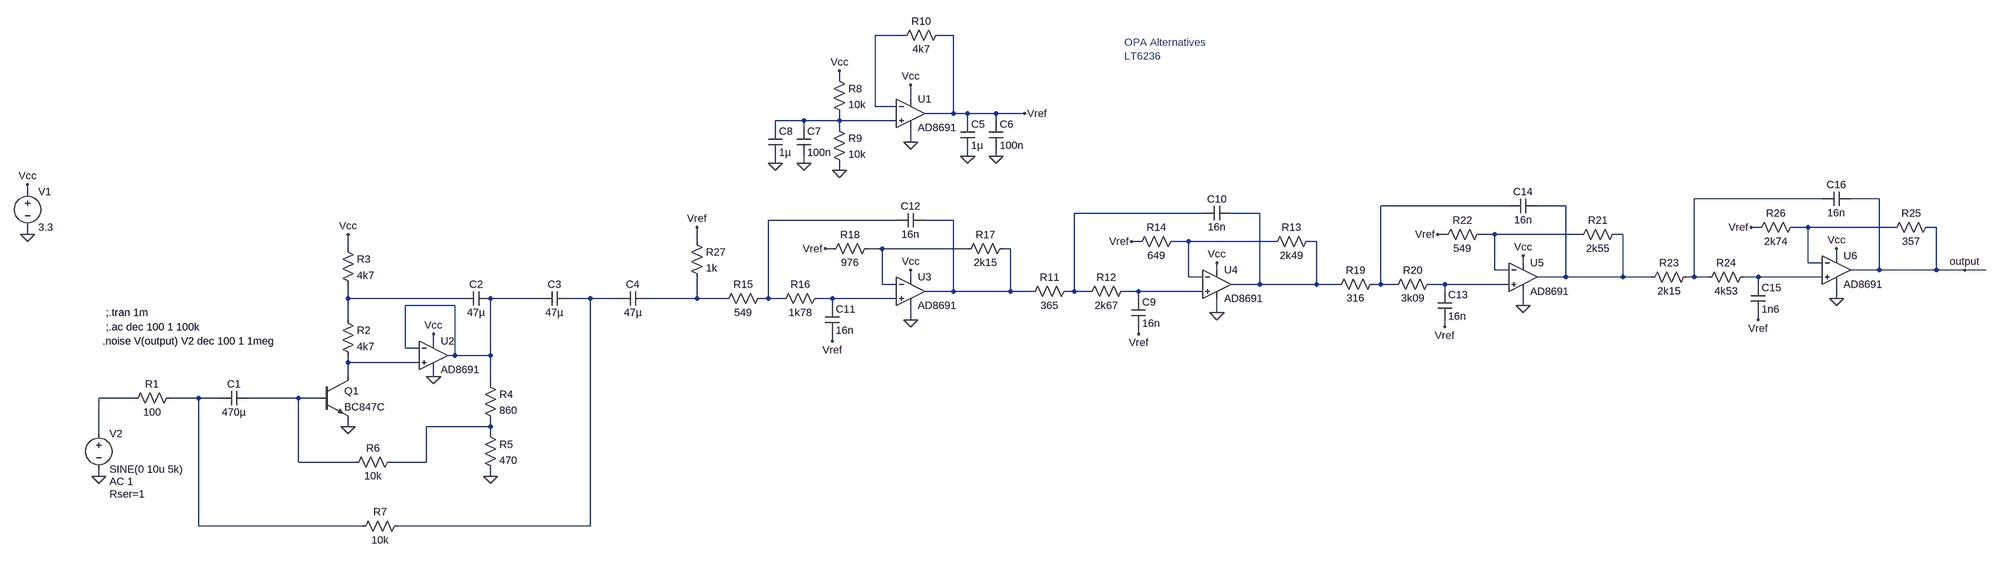
[diagram p0: schematic NPN+Filter.asc]
NPN+Filter.asc, the LTspice schematic file:
Version 4
SHEET 1 5240 900
WIRE 1968 -272 1904 -272
WIRE 2080 -272 2048 -272
WIRE 1824 -176 1824 -192
WIRE 1984 -128 1984 -160
WIRE 1904 -112 1904 -272
WIRE 1952 -112 1904 -112
WIRE 2080 -96 2080 -272
WIRE 2080 -96 2016 -96
WIRE 2112 -96 2080 -96
WIRE 2176 -96 2112 -96
WIRE 2240 -96 2176 -96
WIRE 1744 -80 1680 -80
WIRE 1824 -80 1824 -96
WIRE 1824 -80 1744 -80
WIRE 1952 -80 1824 -80
WIRE 2112 -80 2112 -96
WIRE 2176 -80 2176 -96
WIRE 1680 -64 1680 -80
WIRE 1744 -64 1744 -80
WIRE 1824 -64 1824 -80
WIRE 1984 -32 1984 -64
WIRE 2112 0 2112 -16
WIRE 2176 0 2176 -16
WIRE 1680 16 1680 0
WIRE 1744 16 1744 0
WIRE 1824 32 1824 16
WIRE 0 80 0 64
WIRE 4032 96 3744 96
WIRE 4160 96 4096 96
WIRE 3328 112 3040 112
WIRE 3456 112 3392 112
WIRE 2640 128 2352 128
WIRE 2768 128 2704 128
WIRE 1952 144 1664 144
WIRE 2080 144 2016 144
WIRE 3888 160 3872 160
WIRE 4000 160 3968 160
WIRE 4192 160 4000 160
WIRE 4288 160 4272 160
WIRE 0 176 0 160
WIRE 3184 176 3168 176
WIRE 3296 176 3264 176
WIRE 3488 176 3296 176
WIRE 3584 176 3568 176
WIRE 1504 192 1504 160
WIRE 2496 192 2480 192
WIRE 2608 192 2576 192
WIRE 2800 192 2608 192
WIRE 2896 192 2880 192
WIRE 720 208 720 176
WIRE 1808 208 1792 208
WIRE 1920 208 1888 208
WIRE 2112 208 1920 208
WIRE 2208 208 2192 208
WIRE 4064 224 4064 208
WIRE 3360 240 3360 224
WIRE 4000 240 4000 160
WIRE 4032 240 4000 240
WIRE 2672 256 2672 240
WIRE 3296 256 3296 176
WIRE 3328 256 3296 256
WIRE 4160 256 4160 96
WIRE 4160 256 4096 256
WIRE 4288 256 4288 160
WIRE 4288 256 4160 256
WIRE 4352 256 4288 256
WIRE 4400 256 4352 256
WIRE 1984 272 1984 256
WIRE 2608 272 2608 192
WIRE 2640 272 2608 272
WIRE 3456 272 3456 112
WIRE 3456 272 3392 272
WIRE 3584 272 3584 176
WIRE 3584 272 3456 272
WIRE 3648 272 3584 272
WIRE 3744 272 3744 96
WIRE 3744 272 3728 272
WIRE 3776 272 3744 272
WIRE 3888 272 3856 272
WIRE 4032 272 3888 272
WIRE 1920 288 1920 208
WIRE 1952 288 1920 288
WIRE 2768 288 2768 128
WIRE 2768 288 2704 288
WIRE 2896 288 2896 192
WIRE 2896 288 2768 288
WIRE 2944 288 2896 288
WIRE 3040 288 3040 112
WIRE 3040 288 3024 288
WIRE 3072 288 3040 288
WIRE 3184 288 3152 288
WIRE 3328 288 3184 288
WIRE 3888 288 3888 272
WIRE 2080 304 2080 144
WIRE 2080 304 2016 304
WIRE 2208 304 2208 208
WIRE 2208 304 2080 304
WIRE 2256 304 2208 304
WIRE 2352 304 2352 128
WIRE 2352 304 2336 304
WIRE 2384 304 2352 304
WIRE 2496 304 2464 304
WIRE 2640 304 2496 304
WIRE 3184 304 3184 288
WIRE 720 320 720 288
WIRE 976 320 720 320
WIRE 1152 320 1040 320
WIRE 1264 320 1216 320
WIRE 1328 320 1264 320
WIRE 1504 320 1504 272
WIRE 1504 320 1392 320
WIRE 1568 320 1504 320
WIRE 1664 320 1664 144
WIRE 1664 320 1648 320
WIRE 1696 320 1664 320
WIRE 1808 320 1776 320
WIRE 1952 320 1808 320
WIRE 2496 320 2496 304
WIRE 4064 320 4064 288
WIRE 960 336 848 336
WIRE 1808 336 1808 320
WIRE 3360 336 3360 304
WIRE 2672 352 2672 320
WIRE 720 368 720 320
WIRE 1984 368 1984 336
WIRE 3888 368 3888 352
WIRE 3184 384 3184 368
WIRE 2496 400 2496 384
WIRE 912 416 912 400
WIRE 1808 416 1808 400
WIRE 848 432 848 336
WIRE 880 432 848 432
WIRE 960 448 960 336
WIRE 960 448 944 448
WIRE 1040 448 1040 320
WIRE 1040 448 960 448
WIRE 720 464 720 448
WIRE 880 464 720 464
WIRE 720 496 720 464
WIRE 912 496 912 480
WIRE 1040 512 1040 448
WIRE 240 544 160 544
WIRE 384 544 320 544
WIRE 432 544 384 544
WIRE 608 544 496 544
WIRE 656 544 608 544
WIRE 720 608 720 592
WIRE 1040 608 1040 592
WIRE 1040 608 896 608
WIRE 160 624 160 544
WIRE 1040 624 1040 608
WIRE 608 688 608 544
WIRE 736 688 608 688
WIRE 896 688 896 608
WIRE 896 688 816 688
WIRE 160 720 160 704
WIRE 1040 720 1040 704
WIRE 384 832 384 544
WIRE 752 832 384 832
WIRE 1264 832 1264 320
WIRE 1264 832 832 832
FLAG 0 176 0
FLAG 0 64 Vcc
FLAG 160 720 0
FLAG 720 608 0
FLAG 720 176 Vcc
FLAG 912 400 Vcc
FLAG 912 496 0
FLAG 1040 720 0
FLAG 1984 -32 0
FLAG 1984 -160 Vcc
FLAG 1824 -192 Vcc
FLAG 1824 32 0
FLAG 2112 0 0
FLAG 2176 0 0
FLAG 2240 -96 Vref
FLAG 1680 16 0
FLAG 1744 16 0
FLAG 2496 400 Vref
FLAG 2672 352 0
FLAG 2672 240 Vcc
FLAG 2480 192 Vref
FLAG 1808 416 Vref
FLAG 1984 256 Vcc
FLAG 1792 208 Vref
FLAG 4352 256 output
FLAG 3184 384 Vref
FLAG 3360 336 0
FLAG 3360 224 Vcc
FLAG 3168 176 Vref
FLAG 3888 368 Vref
FLAG 4064 320 0
FLAG 4064 208 Vcc
FLAG 3872 160 Vref
FLAG 1984 368 0
FLAG 1504 160 Vref
SYMBOL voltage 0 64 R0
WINDOW 123 0 0 Left 0
WINDOW 39 0 0 Left 0
SYMATTR InstName V1
SYMATTR Value 3.3
SYMBOL voltage 160 608 R0
WINDOW 123 24 124 Left 2
WINDOW 39 24 152 Left 2
SYMATTR Value2 AC 1
SYMATTR SpiceLine Rser=1
SYMATTR InstName V2
SYMATTR Value SINE(0 10u 5k)
SYMBOL res 336 528 R90
WINDOW 0 0 56 VBottom 2
WINDOW 3 32 56 VTop 2
SYMATTR InstName R1
SYMATTR Value 100
SYMBOL npn 656 496 R0
SYMATTR InstName Q1
SYMATTR Value BC847C
SYMBOL res 704 352 R0
SYMATTR InstName R2
SYMATTR Value 4k7
SYMBOL res 704 192 R0
SYMATTR InstName R3
SYMATTR Value 4k7
SYMBOL cap 1040 304 R90
WINDOW 0 0 32 VBottom 2
WINDOW 3 32 32 VTop 2
SYMATTR InstName C2
SYMATTR Value 47µ
SYMBOL cap 1216 304 R90
WINDOW 0 0 32 VBottom 2
WINDOW 3 32 32 VTop 2
SYMATTR InstName C3
SYMATTR Value 47µ
SYMBOL res 1024 496 R0
SYMATTR InstName R4
SYMATTR Value 860
SYMBOL res 1024 608 R0
SYMATTR InstName R5
SYMATTR Value 470
SYMBOL res 832 672 R90
WINDOW 0 0 56 VBottom 2
WINDOW 3 32 56 VTop 2
SYMATTR InstName R6
SYMATTR Value 10k
SYMBOL res 848 816 R90
WINDOW 0 0 56 VBottom 2
WINDOW 3 32 56 VTop 2
SYMATTR InstName R7
SYMATTR Value 10k
SYMBOL cap 496 528 R90
WINDOW 0 0 32 VBottom 2
WINDOW 3 32 32 VTop 2
SYMATTR InstName C1
SYMATTR Value 470µ
SYMBOL cap 1392 304 R90
WINDOW 0 0 32 VBottom 2
WINDOW 3 32 32 VTop 2
SYMATTR InstName C4
SYMATTR Value 47µ
SYMBOL res 1808 -192 R0
SYMATTR InstName R8
SYMATTR Value 10k
SYMBOL res 1808 -80 R0
SYMATTR InstName R9
SYMATTR Value 10k
SYMBOL cap 2096 -80 R0
SYMATTR InstName C5
SYMATTR Value 1µ
SYMBOL cap 2160 -80 R0
SYMATTR InstName C6
SYMATTR Value 100n
SYMBOL cap 1728 -64 R0
SYMATTR InstName C7
SYMATTR Value 100n
SYMBOL cap 1664 -64 R0
SYMATTR InstName C8
SYMATTR Value 1µ
SYMBOL res 2064 -288 R90
WINDOW 0 0 56 VBottom 2
WINDOW 3 32 56 VTop 2
SYMATTR InstName R10
SYMATTR Value 4k7
SYMBOL res 2352 288 R90
WINDOW 0 0 56 VBottom 2
WINDOW 3 32 56 VTop 2
SYMATTR InstName R11
SYMATTR Value 365
SYMBOL res 2480 288 R90
WINDOW 0 0 56 VBottom 2
WINDOW 3 32 56 VTop 2
SYMATTR InstName R12
SYMATTR Value 2k67
SYMBOL cap 2480 320 R0
SYMATTR InstName C9
SYMATTR Value 16n
SYMBOL cap 2704 112 R90
WINDOW 0 0 32 VBottom 2
WINDOW 3 32 32 VTop 2
SYMATTR InstName C10
SYMATTR Value 16n
SYMBOL res 2896 176 R90
WINDOW 0 0 56 VBottom 2
WINDOW 3 32 56 VTop 2
SYMATTR InstName R13
SYMATTR Value 2k49
SYMBOL res 2592 176 R90
WINDOW 0 0 56 VBottom 2
WINDOW 3 32 56 VTop 2
SYMATTR InstName R14
SYMATTR Value 649
SYMBOL res 1664 304 R90
WINDOW 0 0 56 VBottom 2
WINDOW 3 32 56 VTop 2
SYMATTR InstName R15
SYMATTR Value 549
SYMBOL res 1792 304 R90
WINDOW 0 0 56 VBottom 2
WINDOW 3 32 56 VTop 2
SYMATTR InstName R16
SYMATTR Value 1k78
SYMBOL cap 1792 336 R0
SYMATTR InstName C11
SYMATTR Value 16n
SYMBOL cap 2016 128 R90
WINDOW 0 0 32 VBottom 2
WINDOW 3 32 32 VTop 2
SYMATTR InstName C12
SYMATTR Value 16n
SYMBOL res 2208 192 R90
WINDOW 0 0 56 VBottom 2
WINDOW 3 32 56 VTop 2
SYMATTR InstName R17
SYMATTR Value 2k15
SYMBOL res 1904 192 R90
WINDOW 0 0 56 VBottom 2
WINDOW 3 32 56 VTop 2
SYMATTR InstName R18
SYMATTR Value 976
SYMBOL res 3040 272 R90
WINDOW 0 0 56 VBottom 2
WINDOW 3 32 56 VTop 2
SYMATTR InstName R19
SYMATTR Value 316
SYMBOL res 3168 272 R90
WINDOW 0 0 56 VBottom 2
WINDOW 3 32 56 VTop 2
SYMATTR InstName R20
SYMATTR Value 3k09
SYMBOL cap 3168 304 R0
SYMATTR InstName C13
SYMATTR Value 16n
SYMBOL cap 3392 96 R90
WINDOW 0 0 32 VBottom 2
WINDOW 3 32 32 VTop 2
SYMATTR InstName C14
SYMATTR Value 16n
SYMBOL res 3584 160 R90
WINDOW 0 0 56 VBottom 2
WINDOW 3 32 56 VTop 2
SYMATTR InstName R21
SYMATTR Value 2k55
SYMBOL res 3280 160 R90
WINDOW 0 0 56 VBottom 2
WINDOW 3 32 56 VTop 2
SYMATTR InstName R22
SYMATTR Value 549
SYMBOL res 3744 256 R90
WINDOW 0 0 56 VBottom 2
WINDOW 3 32 56 VTop 2
SYMATTR InstName R23
SYMATTR Value 2k15
SYMBOL res 3872 256 R90
WINDOW 0 0 56 VBottom 2
WINDOW 3 32 56 VTop 2
SYMATTR InstName R24
SYMATTR Value 4k53
SYMBOL cap 3872 288 R0
SYMATTR InstName C15
SYMATTR Value 1n6
SYMBOL cap 4096 80 R90
WINDOW 0 0 32 VBottom 2
WINDOW 3 32 32 VTop 2
SYMATTR InstName C16
SYMATTR Value 16n
SYMBOL res 4288 144 R90
WINDOW 0 0 56 VBottom 2
WINDOW 3 32 56 VTop 2
SYMATTR InstName R25
SYMATTR Value 357
SYMBOL res 3984 144 R90
WINDOW 0 0 56 VBottom 2
WINDOW 3 32 56 VTop 2
SYMATTR InstName R26
SYMATTR Value 2k74
SYMBOL OpAmps\\AD8691 1984 -160 R0
SYMATTR InstName U1
SYMBOL OpAmps\\AD8691 1984 240 R0
SYMATTR InstName U3
SYMBOL OpAmps\\AD8691 2672 224 R0
SYMATTR InstName U4
SYMBOL OpAmps\\AD8691 3360 208 R0
SYMATTR InstName U5
SYMBOL OpAmps\\AD8691 4064 192 R0
SYMATTR InstName U6
SYMBOL res 1488 176 R0
SYMATTR InstName R27
SYMATTR Value 1k
SYMBOL OpAmps\\AD8691 912 384 R0
SYMATTR InstName U2
TEXT 176 352 Left 2 !;.tran 1m
TEXT 176 384 Left 2 !;.ac dec 100 1 100k
TEXT 168 416 Left 2 !.noise V(output) V2 dec 100 1 1meg
TEXT 2464 -256 Left 2 ;OPA Alternatives\nLT6236

The netlist it stands for:
* NPN+Filter.asc
V1 Vcc 0 3.3
V2 N023 0 SINE(0 10u 5k) AC 1 Rser=1
R1 N024 N023 100
Q1 N022 N025 0 0 BC847C
R2 N017 N022 4k7
R3 Vcc N017 4k7
C2 N018 N017 47µ
C3 N019 N018 47µ
R4 N018 N026 860
R5 N026 0 470
R6 N026 N025 10k
R7 N019 N024 10k
C1 N025 N024 470µ
C4 N020 N019 47µ
R8 Vcc N002 10k
R9 N002 0 10k
C5 Vref 0 1µ
C6 Vref 0 100n
C7 N002 0 100n
C8 N002 0 1µ
R10 Vref N001 4k7
R11 N006 N009 365
R12 N016 N006 2k67
C9 N016 Vref 16n
C10 N007 N006 16n
R13 N007 N012 2k49
R14 N012 Vref 649
R15 N008 N020 549
R16 N021 N008 1k78
C11 N021 Vref 16n
C12 N009 N008 16n
R17 N009 N013 2k15
R18 N013 Vref 976
R19 N004 N007 316
R20 N015 N004 3k09
C13 N015 Vref 16n
C14 N005 N004 16n
R21 N005 N011 2k55
R22 N011 Vref 549
R23 N003 N005 2k15
R24 N014 N003 4k53
C15 N014 Vref 1n6
C16 output N003 16n
R25 output N010 357
R26 N010 Vref 2k74
XU1 N002 N001 Vcc 0 Vref AD8691  ; pins In+ In- V+ V- OUT
XU3 N021 N013 Vcc 0 N009 AD8691  ; pins In+ In- V+ V- OUT
XU4 N016 N012 Vcc 0 N007 AD8691  ; pins In+ In- V+ V- OUT
XU5 N015 N011 Vcc 0 N005 AD8691  ; pins In+ In- V+ V- OUT
XU6 N014 N010 Vcc 0 output AD8691  ; pins In+ In- V+ V- OUT
R27 Vref N020 1k
XU2 N022 N018 Vcc 0 N018 AD8691  ; pins In+ In- V+ V- OUT
.model NPN NPN
.model PNP PNP
.lib standard.bjt
;.tran 1m
;.ac dec 100 1 100k
.noise V(output) V2 dec 100 1 1meg
* OPA Alternatives
* LT6236
.backanno
.end